# Altium project Guitar_Synth_Pedal_Rev3_3.PrjPcb (part 2 of 2)
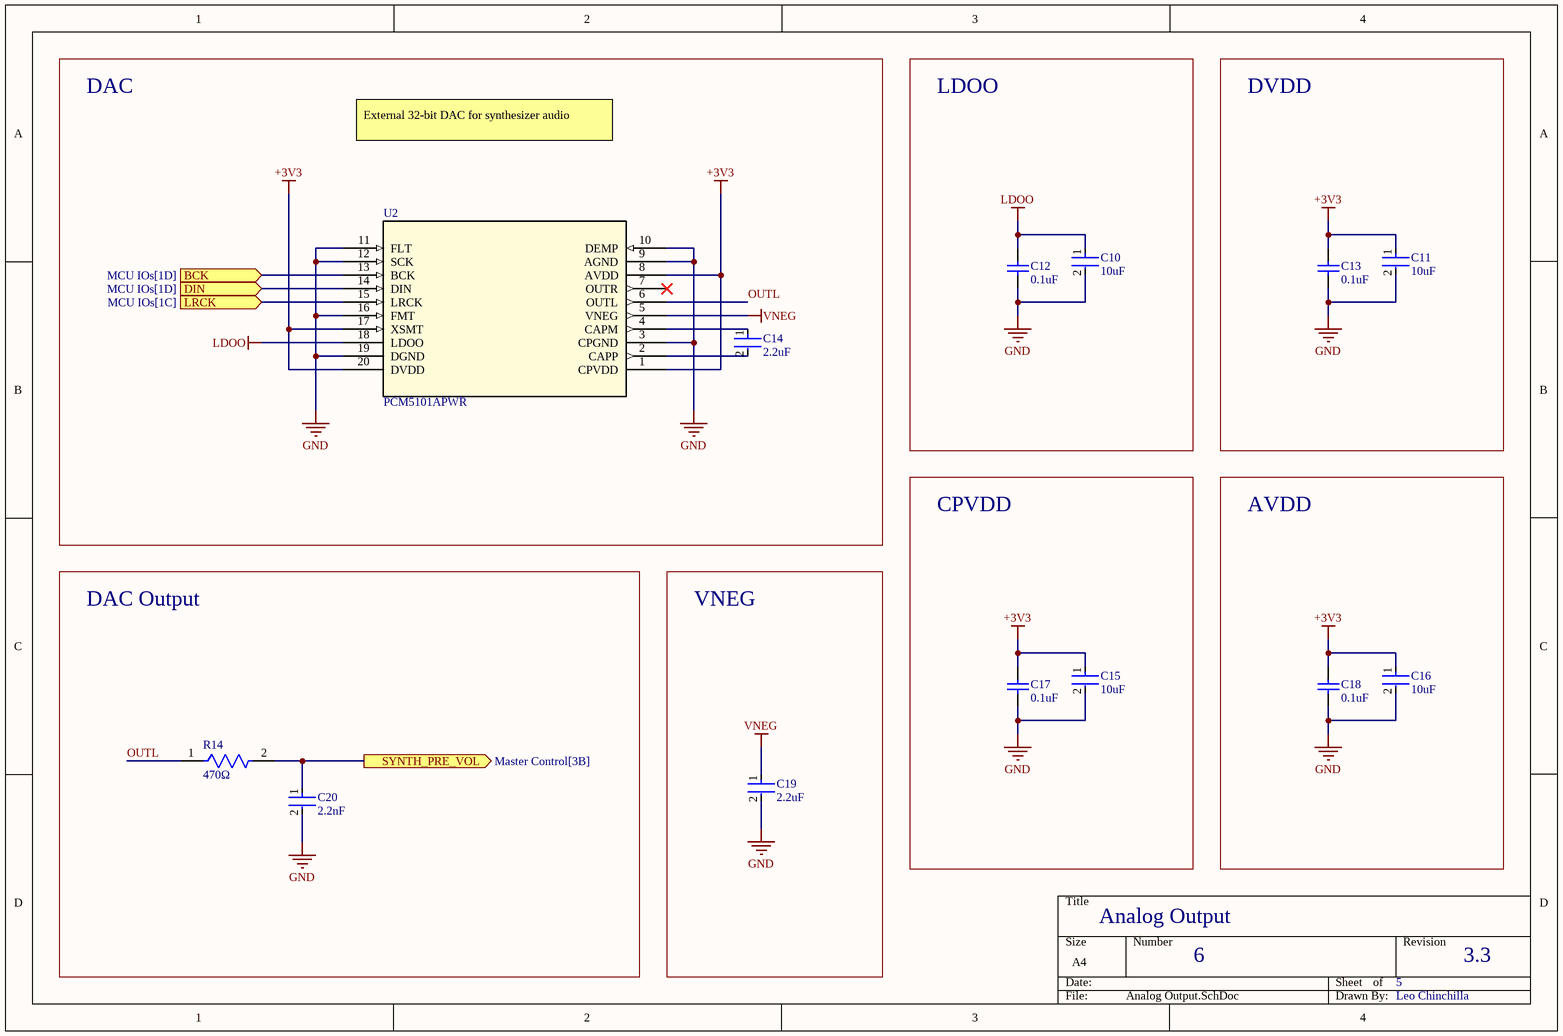
[diagram p6: Analog Output.SchDoc]

## Nets that join several sheets
+3V3: Board Power (C27.1 D3.2 U4.2 U4.4), Analog Input (C1.1 D1.3 R11.2 U1.8), Master Control (8 pins), MCU Power (15 pins), MCU IOs (J4.2), Analog Output (10 pins)
GND: Board Power (11 pins), Analog Input (10 pins), Master Control (10 pins), MCU Power (20 pins), MCU IOs (8 pins), Analog Output (17 pins)
NetC6_1: Analog Input (C6.1 R5.2), MCU IOs (U7.35)
NetC20_1: Master Control (R15.1), Analog Output (C20.1 R14.2)
NetJW3_2: Master Control (JW3.2), MCU IOs (U7.47)
NetJW4_2: Master Control (JW4.2), MCU IOs (U7.71)
NetSW3_1: Master Control (SW3.1), MCU IOs (U7.65)
NetSW3_2: Master Control (SW3.2), MCU IOs (U7.59)
NetSW3_3: Master Control (SW3.3), MCU IOs (U7.67)
NetSW3_4: Master Control (SW3.4), MCU IOs (U7.63)
NetSW3_5: Master Control (SW3.5), MCU IOs (U7.66)
NetSW3_6: Master Control (SW3.6), MCU IOs (U7.60)
NetSW3_7: Master Control (SW3.7), MCU IOs (U7.57)
NetSW3_8: Master Control (SW3.8), MCU IOs (U7.58)
NetSW3_9: Master Control (SW3.9), MCU IOs (U7.62)
NetSW3_10: Master Control (SW3.10), MCU IOs (U7.64)
NetSW3_11: Master Control (SW3.11), MCU IOs (U7.68)
NetSW3_12: Master Control (SW3.12), MCU IOs (U7.61)
NetU2_13: MCU IOs (U7.4), Analog Output (U2.13)
NetU2_14: MCU IOs (U7.5), Analog Output (U2.14)
NetU2_15: MCU IOs (U7.3), Analog Output (U2.15)
NetU5_3: Master Control (U5.3), MCU IOs (U7.44)
PEDAL_IN: Analog Input (C7.1 R13.1), Master Control (J2.2 U5.1)